# Altium project 带继电器产品.PrjPCB
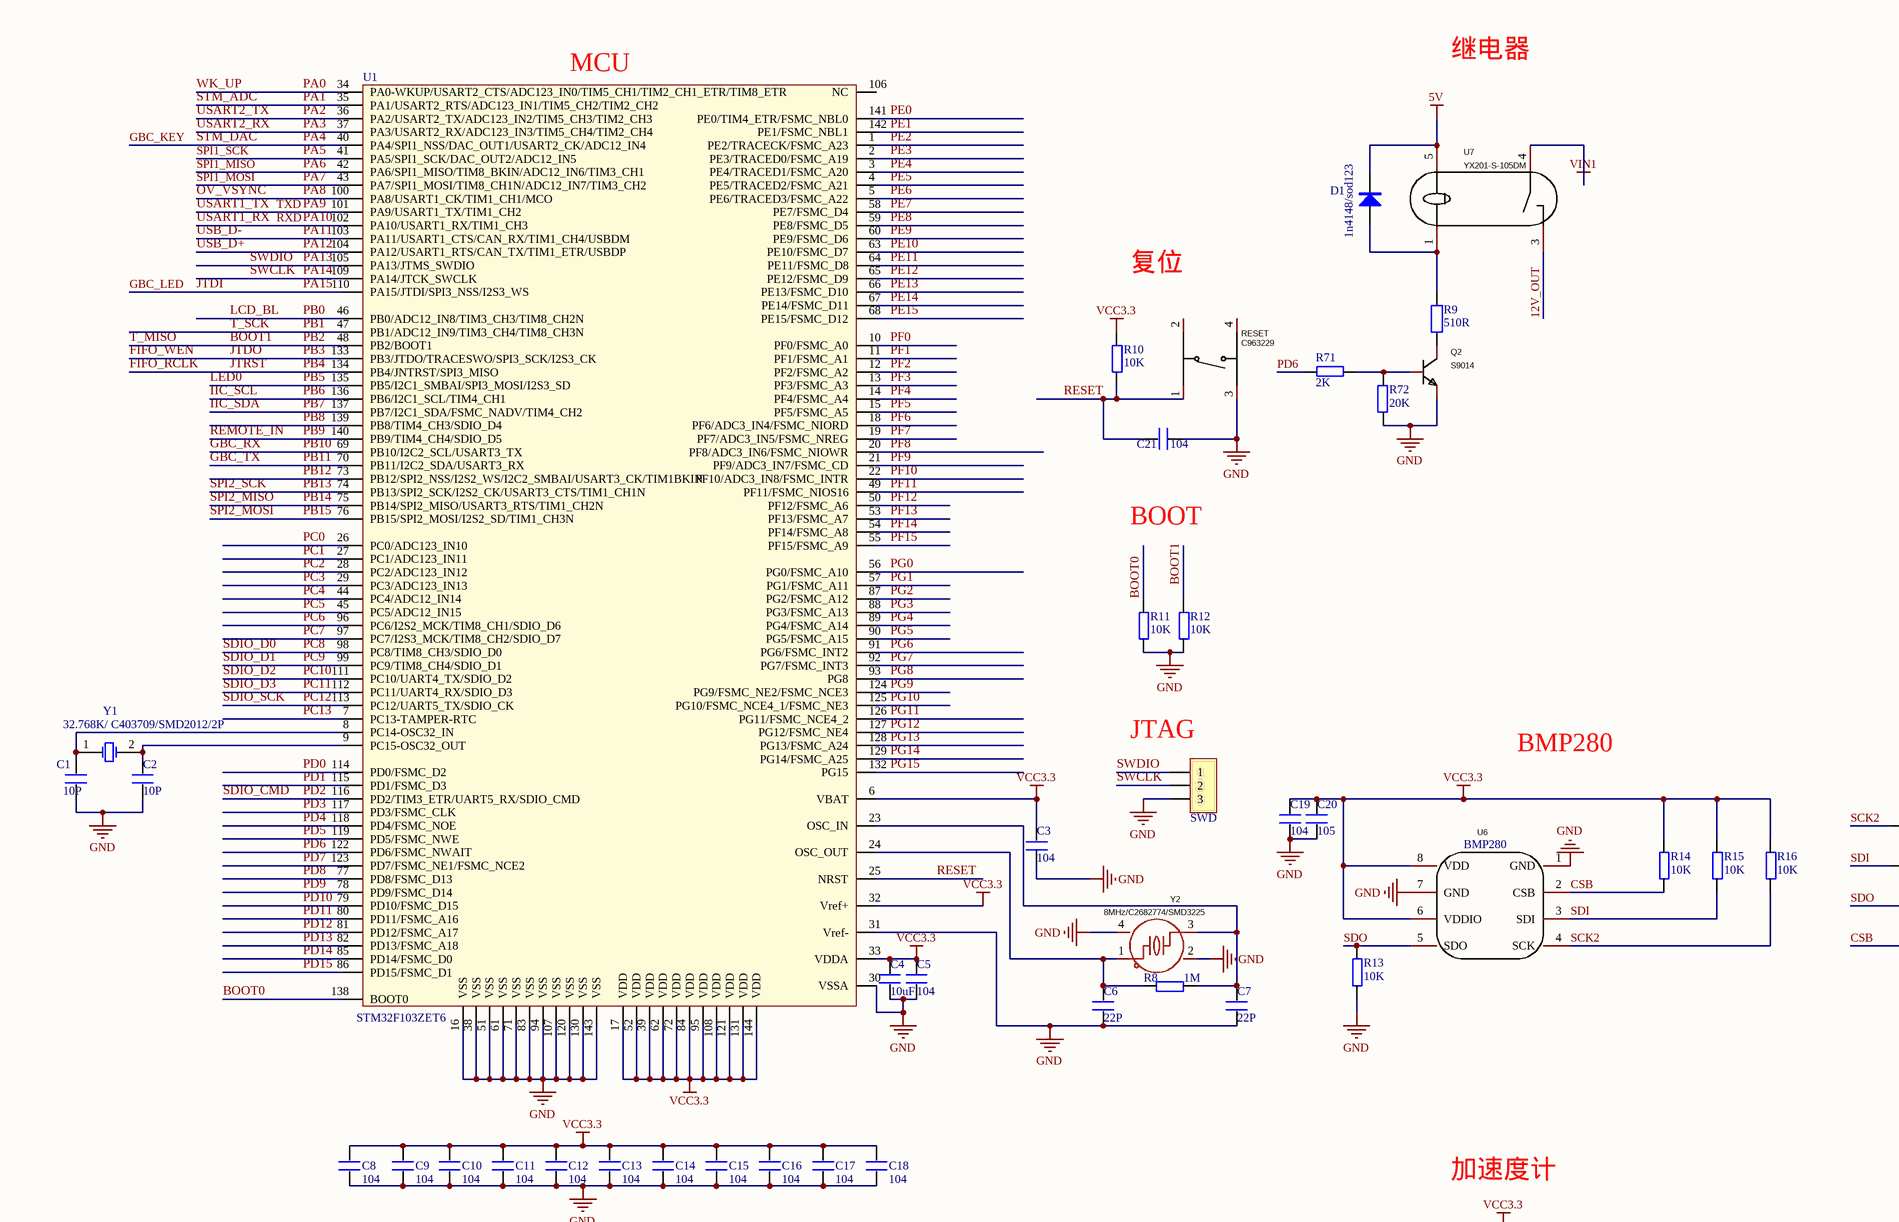
[diagram p0: 带继电器产品.SchDoc, top left]
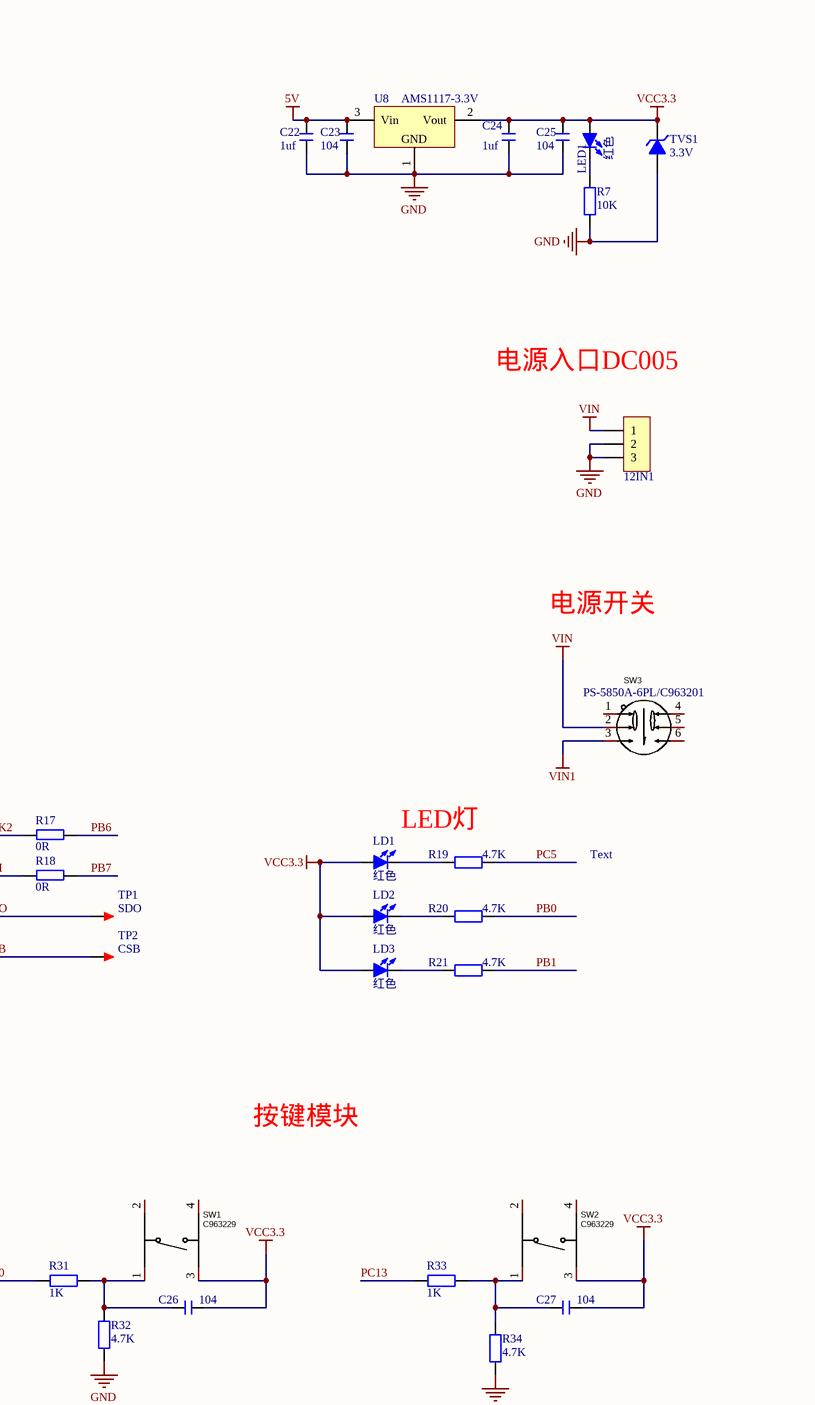
[diagram p1: 带继电器产品.SchDoc, top right]
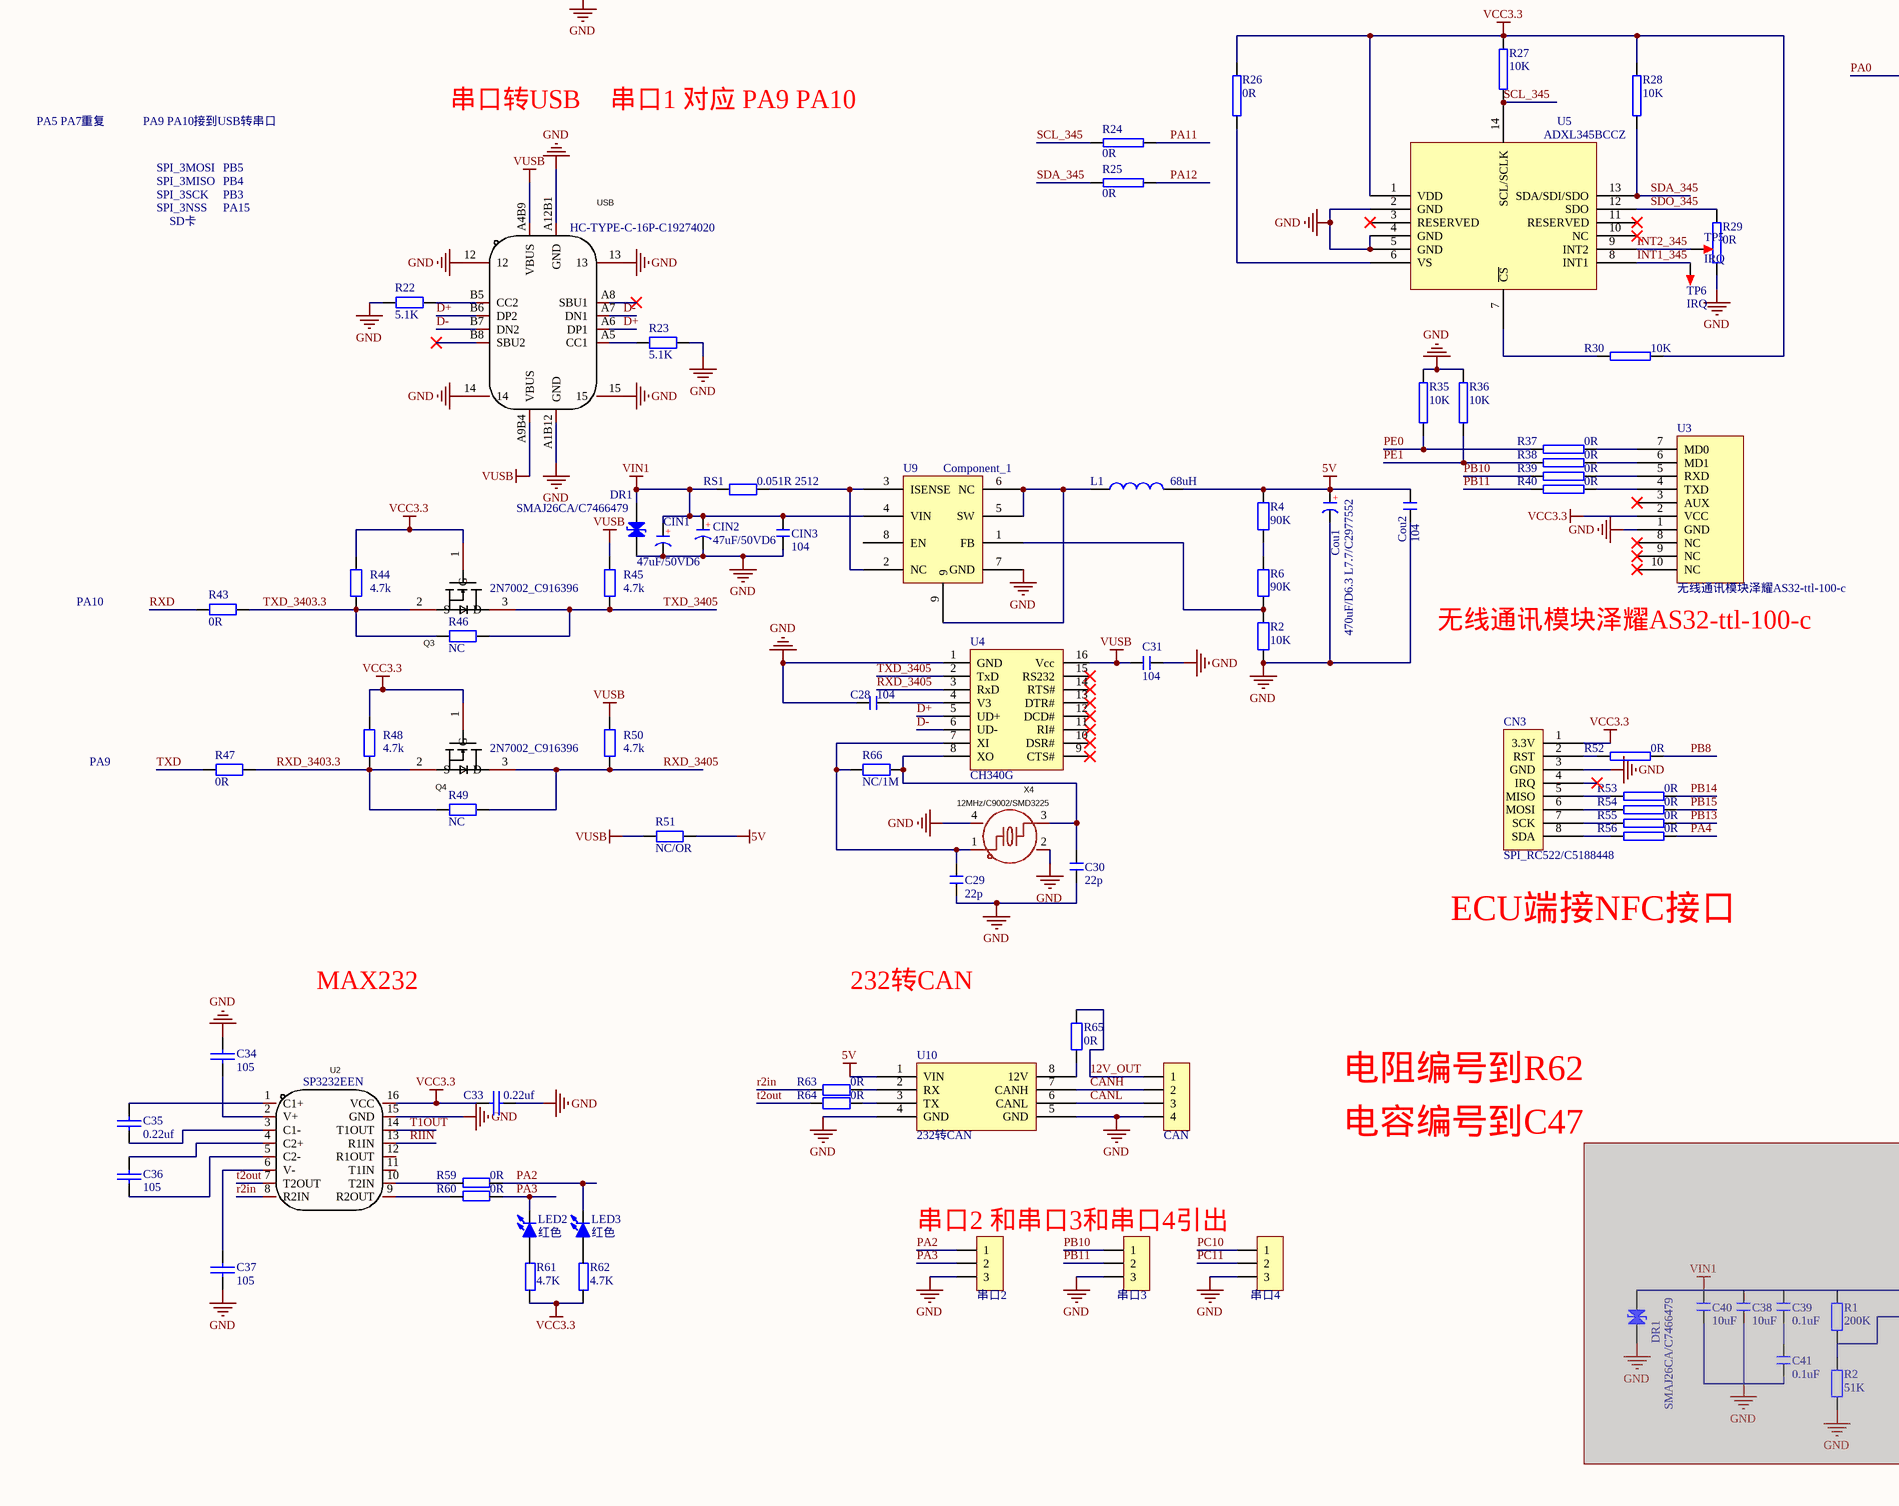
[diagram p2: 带继电器产品.SchDoc, bottom left]
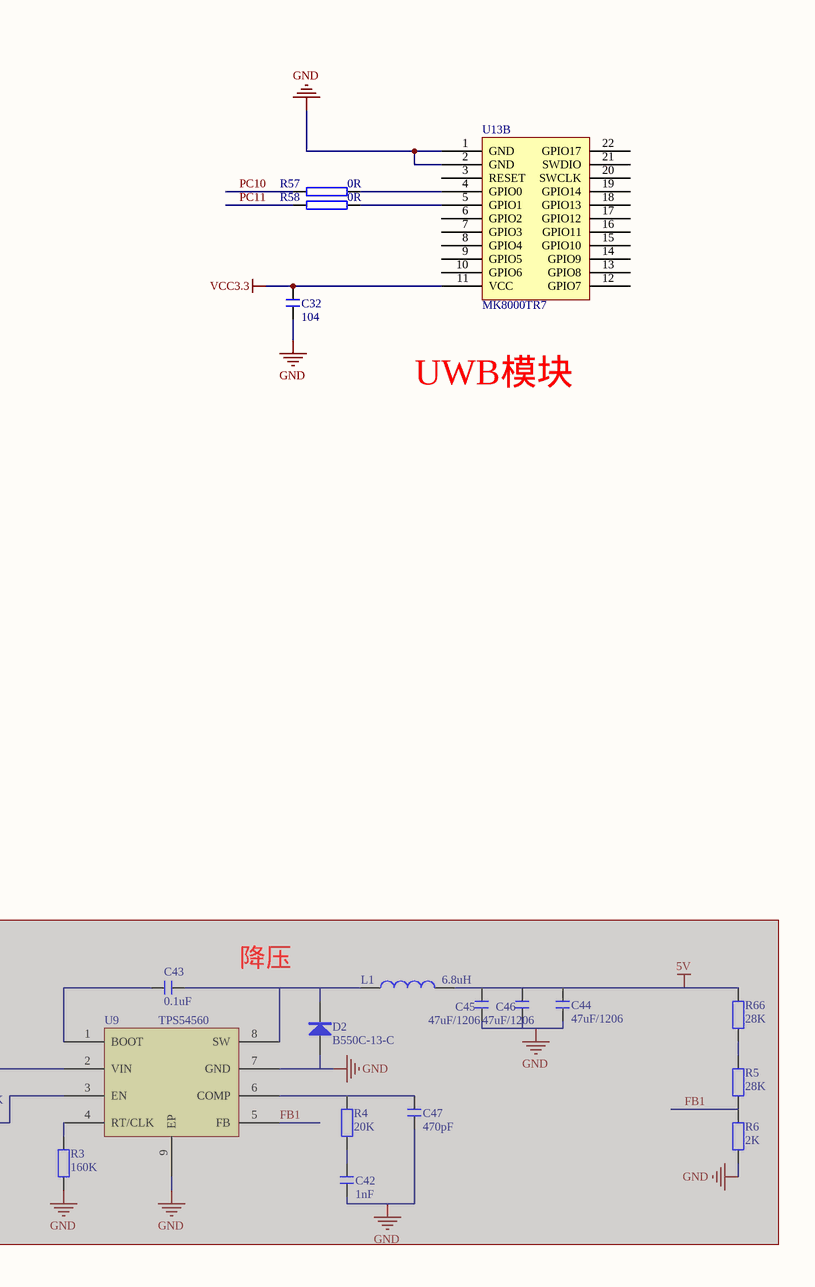
[diagram p3: 带继电器产品.SchDoc, bottom right]
1 sheet, 170 parts. Net scope: global (net labels, ports and power ports of the same name join across sheets).
Board file: 带继电器产品.PcbDoc

## Sheet 带继电器产品.SchDoc
size 508 x 508 mm

### Parts
(Parts that share a designator on the sheet are numbered #1, #2 ... from top to bottom, then left to right.)
12IN1  HDR-1X3  [DC-005]  (value not drawn)
C1  10P  [C0603_L]
C2  10P  [C0603_L]
C3  104  [C0603_L]
C4  10uF  [C0603_L]
C5  104  [C0603_L]
C6  22P  [C0603_L]
C7  22P  [C0603_L]
C8  104  [C0603_L]
C9  104  [C0603_L]
C10  104  [C0603_L]
C11  104  [C0603_L]
C12  104  [C0603_L]
C13  104  [C0603_L]
C14  104  [C0603_L]
C15  104  [C0603_L]
C16  104  [C0603_L]
C17  104  [C0603_L]
C18  104  [C0603_L]
C19  104  [C0603_L]
C20  105  [C0603_L]
C21  104  [C0603_L]
C22  1uf  [C0603_L]
C23  104  [C0603_L]
C24  1uf  [C0603_L]
C25  104  [C0603_L]
C26  104  [C0603_L]
C27  104  [C0603_L]
C28  104  [C0603_L]
C29  22p  [C0603_L]
C30  22p  [C0603_L]
C31  104  [C0603_L]
C32  104  [C0603_L]
C33  0.22uf  [C0603_L]
C34  105  [C0603_L]
C35  0.22uf  [C0603_L]
C36  105  [C0603_L]
C37  105  [C0603_L]
C38  10uF  [C0603_L]  (masked out: inside a compile mask, not in the netlist)
C39  0.1uF  [C0603_L]  (masked out: inside a compile mask, not in the netlist)
C40  10uF  [C0603_L]  (masked out: inside a compile mask, not in the netlist)
C41  0.1uF  [C0603_L]  (masked out: inside a compile mask, not in the netlist)
C42  1nF  [C0603_L]  (masked out: inside a compile mask, not in the netlist)
C43  0.1uF  [C0603_L]  (masked out: inside a compile mask, not in the netlist)
C44  47uF/1206  [C1206_L]  (masked out: inside a compile mask, not in the netlist)
C45  47uF/1206  [C1206_L]  (masked out: inside a compile mask, not in the netlist)
C46  47uF/1206  [C1206_L]  (masked out: inside a compile mask, not in the netlist)
C47  470pF  [C0603_L]  (masked out: inside a compile mask, not in the netlist)
CAN  HDR-1X4  [CAN/4P]  (value not drawn)
CIN1  47uF/50VD6  [C0805_L]
CIN2  47uF/50VD6  [C0805_L]
CIN3  104  [C0603_L]
CN3  SPI_RC522/C5188448  [SPI/8P]
Cou1  470uF/D6.3 L7.7/C2977552  [D6.3/470uf]
Cou2  104  [C0603_L]
D1  1n4148/sod123  [SOD-123]
D2  B550C-13-C  [SS56]  (masked out: inside a compile mask, not in the netlist)
DR1#1  SMAJ26CA/C7466479  [TVS]
DR1#2  SMAJ26CA/C7466479  [TVS]  (masked out: inside a compile mask, not in the netlist)
L1#1  68uH  [0530]
L1#2  6.8uH  [电感0650]  (masked out: inside a compile mask, not in the netlist)
LD1  红色  [LED0603_Y]
LD2  红色  [LED0603_Y]
LD3  红色  [LED0603_Y]
LED1  红色  [LED0603_Y]
LED2  红色  [LED0603_Y]
LED3  红色  [LED0603_Y]
Q2  S9014  [9014]
Q3  2N7002_C916396  [2N7002]
Q4  2N7002_C916396  [2N7002]
R1  200K  [R0603_L]  (masked out: inside a compile mask, not in the netlist)
R2#1  10K  [R0603_L]
R2#2  51K  [R0603_L]  (masked out: inside a compile mask, not in the netlist)
R3  160K  [R0603_L]  (masked out: inside a compile mask, not in the netlist)
R4#1  90K  [R0603_L]
R4#2  20K  [R0603_L]  (masked out: inside a compile mask, not in the netlist)
R5  28K  [R0603_L]  (masked out: inside a compile mask, not in the netlist)
R6#1  90K  [R0603_L]
R6#2  2K  [R0603_L]  (masked out: inside a compile mask, not in the netlist)
R7  10K  [R0603_L]
R8  1M  [R0603_L]
R9  510R  [R0603_L]
R10  10K  [R0603_L]
R11  10K  [R0603_L]
R12  10K  [R0603_L]
R13  10K  [R0603_L]
R14  10K  [R0603_L]
R15  10K  [R0603_L]
R16  10K  [R0603_L]
R17  0R  [R0603_L]
R18  0R  [R0603_L]
R19  4.7K  [R0603_L]
R20  4.7K  [R0603_L]
R21  4.7K  [R0603_L]
R22  5.1K  [R0603_L]
R23  5.1K  [R0603_L]
R24  0R  [R0603_L]
R25  0R  [R0603_L]
R26  0R  [R0603_L]
R27  10K  [R0603_L]
R28  10K  [R0603_L]
R29  0R  [R0603_L]
R30  10K  [R0603_L]
R31  1K  [R0603_L]
R32  4.7K  [R0603_L]
R33  1K  [R0603_L]
R34  4.7K  [R0603_L]
R35  10K  [R0603_L]
R36  10K  [R0603_L]
R37  0R  [R0603_L]
R38  0R  [R0603_L]
R39  0R  [R0603_L]
R40  0R  [R0603_L]
R43  0R  [R0603_L]
R44  4.7k  [R0603_L]
R45  4.7k  [R0603_L]
R46  NC  [R0603_L]
R47  0R  [R0603_L]
R48  4.7k  [R0603_L]
R49  NC  [R0603_L]
R50  4.7k  [R0603_L]
R51  NC/OR  [R0603_L]
R52  0R  [R0603_L]
R53  0R  [R0603_L]
R54  0R  [R0603_L]
R55  0R  [R0603_L]
R56  0R  [R0603_L]
R57  0R  [R0603_L]
R58  0R  [R0603_L]
R59  0R  [R0603_L]
R60  0R  [R0603_L]
R61  4.7K  [R0603_L]
R62  4.7K  [R0603_L]
R63  0R  [R0603_L]
R64  0R  [R0603_L]
R65  0R  [R0603_L]
R66#1  NC/1M  [R0603_L]
R66#2  28K  [R0603_L]  (masked out: inside a compile mask, not in the netlist)
R71  2K  [R0603_L]
R72  20K  [R0603_L]
RESET  C963229  [按键4.5*4.5]
RS1  0.051R 2512  [R1206_L]
SW1  C963229  [按键4.5*4.5]
SW2  C963229  [按键4.5*4.5]
SW3  PS-5850A-6PL/C963201  [电源开关]
SWD  HDR-1X3  [HDR2.54-LI-3P]  (value not drawn)
TP1  SDO  [测试点]
TP2  CSB  [测试点]
TP5  IRQ  [测试点]
TP6  IRQ  [测试点]
TVS1  3.3V  [SOD-123]
U1  STM32F103ZET6  [STME32F103ZET6]
U2  SP3232EEN  [max232]
U3  无线通讯模块泽耀AS32-ttl-100-c  [YAOZE]
U4  CH340G  [SOP16_M]
U5  ADXL345BCCZ  [ADXL345]
U6  BMP280  [BMP280]
U7  YX201-S-105DM  [继电器]
U8  AMS1117-3.3V  [1117-3.3]
U9#1  Component_1  [H4025/9脚]
U9#2  TPS54560  [TPS54560]  (masked out: inside a compile mask, not in the netlist)
U10  232转CAN  [CAN模块]
U13  MK8000TR7  [MK8000 PCB_V1.0封装]  (part B of 2)
USB  HC-TYPE-C-16P-C19274020  [TYPEC]
X4  12MHz/C9002/SMD3225  [SMD3225]
Y1  32.768K/ C403709/SMD2012/2P  [32.768K]
Y2  8MHz/C2682774/SMD3225  [SMD3225]
串口2  HDR-1X3  [HDR2.54-LI-3P]  (value not drawn)
串口3  HDR-1X3  [HDR2.54-LI-3P]  (value not drawn)
串口4  HDR-1X3  [HDR2.54-LI-3P]  (value not drawn)

### Nets
5V: C22.2 C23.2 Cou1.1(A) Cou2.2 D1.2(K) L1#1.2 R4#1.2 R51.2 U7.5 U8.3(Vin) U10.1(VIN)
GND: 12IN1.2 12IN1.3 C1.1 C2.1 C3.1 C4.1 C5.1 C6.1 C7.1 C8.2 C9.2 C10.2 C11.2 C12.2 C13.2 C14.2 C15.2 C16.2 C17.2 C18.2 C19.1 C20.1 C21.1 C22.1 C23.1 C24.1 C25.1 C28.1 C29.1 C30.1 C31.1 C32.2 C33.2 C34.1 C37.2 CAN.4 CIN1.2(K) CIN2.2(K) CIN3.1 CN3.3(GND) Cou1.2(K) Cou2.1 DR1#1.2(K) Q2.2(E) R2#1.1 R7.1 R11.1 R12.1 R13.1 R22.1 R23.2 R29.1 R32.1 R34.1 R35.2 R36.2 R72.2 RESET.3 SWD.3 TVS1.1(A) U1.16(VSS) U1.30(VSSA) U1.31(Vref-) U1.38(VSS) U1.51(VSS) U1.61(VSS) U1.71(VSS) U1.83(VSS) U1.94(VSS) U1.107(VSS) U1.120(VSS) U1.130(VSS) U1.143(VSS) U2.15(GND) U3.1(GND) U4.1(GND) U5.2(GND) U5.4(GND) U5.5(GND) U6.1(GND) U6.7(GND) U8.1(GND) U9#1.7(GND) U10.4(GND) U10.5(GND) U13.1(GND) U13.2(GND) USB.12 USB.13 USB.14 USB.15 USB.A1B12(GND) USB.A12B1(GND) X4.2(GND) X4.4(GND) Y2.2(GND) Y2.4(GND) 串口2.3 串口3.3 串口4.3
VCC3.3: C3.2 C4.2 C5.2 C8.1 C9.1 C10.1 C11.1 C12.1 C13.1 C14.1 C15.1 C16.1 C17.1 C18.1 C19.2 C20.2 C24.2 C25.2 C26.1 C27.1 C32.1 C33.1 CN3.1(3.3V) LD1.1(A) LD2.1(A) LD3.1(A) LED1.1(A) Q3.1(G) Q4.1(G) R10.2 R14.2 R15.2 R16.2 R26.2 R27.2 R28.2 R30.2 R44.2 R48.2 R61.1 R62.1 SW1.3 SW2.3 TVS1.2(K) U1.6(VBAT) U1.17(VDD) U1.32(Vref+) U1.33(VDDA) U1.39(VDD) U1.52(VDD) U1.62(VDD) U1.72(VDD) U1.84(VDD) U1.95(VDD) U1.108(VDD) U1.121(VDD) U1.131(VDD) U1.144(VDD) U2.16(VCC) U3.2(VCC) U5.1(VDD) U6.6(VDDIO) U6.8(VDD) U8.2(Vout) U13.11(VCC)
VIN: 12IN1.1 SW3.2
VIN1: CIN1.1(A) CIN2.1(A) CIN3.2 DR1#1.1(A) RS1.1 SW3.3 U7.4 U9#1.4(VIN)
VUSB: C31.2 R45.2 R50.2 R51.1 U4.16(Vcc) USB.A4B9(VBUS) USB.A9B4(VBUS)
12V_OUT: CAN.1 R65.2 U7.3
BOOT0: R11.2 U1.138(BOOT0)
BOOT1: R12.2 U1.48(PB2/BOOT1)  [also labelled PB2, T_MISO]
CANH: CAN.2 U10.7(CANH)
CANL: CAN.3 U10.6(CANL)
CSB: R14.1 TP2.1 U6.2(CSB)
D+: U4.5(UD+) USB.A6(DP1) USB.B6(DP2)
D-: U4.6(UD-) USB.A7(DN1) USB.B7(DN2)
FIFO_RCLK: U1.134(PB4/JNTRST/SPI3_MISO)  [also labelled JTRST, PB4]
FIFO_WEN: U1.133(PB3/JTDO/TRACESWO/SPI3_SCK/I2S3_CK)  [also labelled JTDO, PB3]
GBC_KEY: R56.2 U1.40(PA4/SPI1_NSS/DAC_OUT1/USART2_CK/ADC12_IN4)  [also labelled PA4, STM_DAC]
GBC_LED: U1.110(PA15/JTDI/SPI3_NSS/I2S3_WS)  [also labelled JTDI, PA15]
GBC_RX: R39.1 U1.69(PB10/I2C2_SCL/USART3_TX) 串口3.1  [also labelled PB10]
GBC_TX: R40.1 U1.70(PB11/I2C2_SDA/USART3_RX) 串口3.2  [also labelled PB11]
IIC_SCL: R17.1 U1.136(PB6/I2C1_SCL/TIM4_CH1)  [also labelled PB6]
IIC_SDA: R18.1 U1.137(PB7/I2C1_SDA/FSMC_NADV/TIM4_CH2)  [also labelled PB7]
INT1_345: TP6.1 U5.8(INT1)
INT2_345: TP5.1 U5.9(INT2)
LCD_BL: R20.1 U1.46(PB0/ADC12_IN8/TIM3_CH3/TIM8_CH2N)  [also labelled PB0]
LED0: U1.135(PB5/I2C1_SMBAI/SPI3_MOSI/I2S3_SD)  [also labelled PB5]
OV_VSYNC: U1.100(PA8/USART1_CK/TIM1_CH1/MCO)  [also labelled PA8]
PA0: R31.1 U1.34(PA0-WKUP/USART2_CTS/ADC123_IN0/TIM5_CH1/TIM2_CH1_ETR/TIM8_ETR)  [also labelled WK_UP]
PA1: U1.35(PA1/USART2_RTS/ADC123_IN1/TIM5_CH2/TIM2_CH2)  [also labelled STM_ADC]
PA2: LED3.2(K) R59.1 U1.36(PA2/USART2_TX/ADC123_IN2/TIM5_CH3/TIM2_CH3) 串口2.1  [also labelled USART2_TX]
PA3: LED2.2(K) R60.1 U1.37(PA3/USART2_RX/ADC123_IN3/TIM5_CH4/TIM2_CH4) 串口2.2  [also labelled USART2_RX]
PA5: U1.41(PA5/SPI1_SCK/DAC_OUT2/ADC12_IN5)  [also labelled SPI1_SCK]
PA6: U1.42(PA6/SPI1_MISO/TIM8_BKIN/ADC12_IN6/TIM3_CH1)  [also labelled SPI1_MISO]
PA7: U1.43(PA7/SPI1_MOSI/TIM8_CH1N/ADC12_IN7/TIM3_CH2)  [also labelled SPI1_MOSI]
PA9: R47.2 U1.101(PA9/USART1_TX/TIM1_CH2)  [also labelled TXD, USART1_TX]
PA10: R43.2 U1.102(PA10/USART1_RX/TIM1_CH3)  [also labelled RXD, USART1_RX]
PA11: R24.1 U1.103(PA11/USART1_CTS/CAN_RX/TIM1_CH4/USBDM)  [also labelled USB_D-]
PA12: R25.1 U1.104(PA12/USART1_RTS/CAN_TX/TIM1_ETR/USBDP)  [also labelled USB_D+]
PA13: SWD.1 U1.105(PA13/JTMS_SWDIO)  [also labelled SWDIO]
PA14: SWD.2 U1.109(PA14/JTCK_SWCLK)  [also labelled SWCLK]
PB1: R21.1 U1.47(PB1/ADC12_IN9/TIM3_CH4/TIM8_CH3N)  [also labelled T_SCK]
PB8: R52.2 U1.139(PB8/TIM4_CH3/SDIO_D4)
PB9: U1.140(PB9/TIM4_CH4/SDIO_D5)  [also labelled REMOTE_IN]
PB12: U1.73(PB12/SPI2_NSS/I2S2_WS/I2C2_SMBAI/USART3_CK/TIM1BKIN)
PB13: R55.2 U1.74(PB13/SPI2_SCK/I2S2_CK/USART3_CTS/TIM1_CH1N)  [also labelled SPI2_SCK]
PB14: R53.2 U1.75(PB14/SPI2_MISO/USART3_RTS/TIM1_CH2N)  [also labelled SPI2_MISO]
PB15: R54.2 U1.76(PB15/SPI2_MOSI/I2S2_SD/TIM1_CH3N)  [also labelled SPI2_MOSI]
PC0: U1.26(PC0/ADC123_IN10)
PC1: U1.27(PC1/ADC123_IN11)
PC2: U1.28(PC2/ADC123_IN12)
PC3: U1.29(PC3/ADC123_IN13)
PC4: U1.44(PC4/ADC12_IN14)
PC5: R19.1 U1.45(PC5/ADC12_IN15)
PC6: U1.96(PC6/I2S2_MCK/TIM8_CH1/SDIO_D6)
PC7: U1.97(PC7/I2S3_MCK/TIM8_CH2/SDIO_D7)
PC8: U1.98(PC8/TIM8_CH3/SDIO_D0)  [also labelled SDIO_D0]
PC9: U1.99(PC9/TIM8_CH4/SDIO_D1)  [also labelled SDIO_D1]
PC10: R57.1 U1.111(PC10/UART4_TX/SDIO_D2) 串口4.1  [also labelled SDIO_D2]
PC11: R58.1 U1.112(PC11/UART4_RX/SDIO_D3) 串口4.2  [also labelled SDIO_D3]
PC12: U1.113(PC12/UART5_TX/SDIO_CK)  [also labelled SDIO_SCK]
PC13: R33.1 U1.7(PC13-TAMPER-RTC)
PD0: U1.114(PD0/FSMC_D2)
PD1: U1.115(PD1/FSMC_D3)
PD2: U1.116(PD2/TIM3_ETR/UART5_RX/SDIO_CMD)  [also labelled SDIO_CMD]
PD3: U1.117(PD3/FSMC_CLK)
PD4: U1.118(PD4/FSMC_NOE)
PD5: U1.119(PD5/FSMC_NWE)
PD6: R71.2 U1.122(PD6/FSMC_NWAIT)
PD7: U1.123(PD7/FSMC_NE1/FSMC_NCE2)
PD8: U1.77(PD8/FSMC_D13)
PD9: U1.78(PD9/FSMC_D14)
PD10: U1.79(PD10/FSMC_D15)
PD11: U1.80(PD11/FSMC_A16)
PD12: U1.81(PD12/FSMC_A17)
PD13: U1.82(PD13/FSMC_A18)
PD14: U1.85(PD14/FSMC_D0)
PD15: U1.86(PD15/FSMC_D1)
PE0: R35.1 R37.1 U1.141(PE0/TIM4_ETR/FSMC_NBL0)
PE1: R36.1 R38.1 U1.142(PE1/FSMC_NBL1)
PE2: U1.1(PE2/TRACECK/FSMC_A23)
PE3: U1.2(PE3/TRACED0/FSMC_A19)
PE4: U1.3(PE4/TRACED1/FSMC_A20)
PE5: U1.4(PE5/TRACED2/FSMC_A21)
PE6: U1.5(PE6/TRACED3/FSMC_A22)
PE7: U1.58(PE7/FSMC_D4)
PE8: U1.59(PE8/FSMC_D5)
PE9: U1.60(PE9/FSMC_D6)
PE10: U1.63(PE10/FSMC_D7)
PE11: U1.64(PE11/FSMC_D8)
PE12: U1.65(PE12/FSMC_D9)
PE13: U1.66(PE13/FSMC_D10)
PE14: U1.67(PE14/FSMC_D11)
PE15: U1.68(PE15/FSMC_D12)
PF0: U1.10(PF0/FSMC_A0)
PF1: U1.11(PF1/FSMC_A1)
PF2: U1.12(PF2/FSMC_A2)
PF3: U1.13(PF3/FSMC_A3)
PF4: U1.14(PF4/FSMC_A4)
PF5: U1.15(PF5/FSMC_A5)
PF6: U1.18(PF6/ADC3_IN4/FSMC_NIORD)
PF7: U1.19(PF7/ADC3_IN5/FSMC_NREG)
PF8: U1.20(PF8/ADC3_IN6/FSMC_NIOWR)
PF9: U1.21(PF9/ADC3_IN7/FSMC_CD)
PF10: U1.22(PF10/ADC3_IN8/FSMC_INTR)
PF11: U1.49(PF11/FSMC_NIOS16)
PF12: U1.50(PF12/FSMC_A6)
PF13: U1.53(PF13/FSMC_A7)
PF14: U1.54(PF14/FSMC_A8)
PF15: U1.55(PF15/FSMC_A9)
PG0: U1.56(PG0/FSMC_A10)
PG1: U1.57(PG1/FSMC_A11)
PG2: U1.87(PG2/FSMC_A12)
PG3: U1.88(PG3/FSMC_A13)
PG4: U1.89(PG4/FSMC_A14)
PG5: U1.90(PG5/FSMC_A15)
PG6: U1.91(PG6/FSMC_INT2)
PG7: U1.92(PG7/FSMC_INT3)
PG8: U1.93(PG8)
PG9: U1.124(PG9/FSMC_NE2/FSMC_NCE3)
PG10: U1.125(PG10/FSMC_NCE4_1/FSMC_NE3)
PG11: U1.126(PG11/FSMC_NCE4_2)
PG12: U1.127(PG12/FSMC_NE4)
PG13: U1.128(PG13/FSMC_A24)
PG14: U1.129(PG14/FSMC_A25)
PG15: U1.132(PG15)
r2in: R63.1 U2.8(R2IN)
RESET: C21.2 R10.1 RESET.1 U1.25(NRST)
RIIN: U2.13(R1IN)
RXD_3403.3: Q4.2(S) R47.1 R48.1 R49.2
RXD_3405: Q4.3(D) R49.1 R50.1 U4.3(RxD)
SCK2: R16.1 R17.2 U6.4(SCK)
SCL_345: R24.2 R27.1 U5.14(SCL/SCLK)
SDA_345: R25.2 R28.1 U5.13(SDA/SDI/SDO)
SDI: R15.1 R18.2 U6.3(SDI)
SDO: R13.2 TP1.1 U6.5(SDO)
SDO_345: R29.2 U5.12(SDO)
T1OUT: U2.14(T1OUT)
t2out: R64.1 U2.7(T2OUT)
TXD_3403.3: Q3.2(S) R43.1 R44.1 R46.2
TXD_3405: Q3.3(D) R45.1 R46.1 U4.2(TxD)
NetC1_2: C1.2 U1.8(PC14-OSC32_IN) Y1.1(OSC1)
NetC2_2: C2.2 U1.9(PC15-OSC32_OUT) Y1.2(OSC2)
NetC6_2: C6.2 R8.1 U1.24(OSC_OUT) Y2.1
NetC7_2: C7.2 R8.2 U1.23(OSC_IN) Y2.3
NetC26_2: C26.2 R31.2 R32.2 SW1.1
NetC27_2: C27.2 R33.2 R34.2 SW2.1
NetC28_2: C28.2 U4.4(V3)
NetC29_2: C29.2 R66#1.1 U4.7(XI) X4.1
NetC30_2: C30.2 R66#1.2 U4.8(XO) X4.3
NetC34_2: C34.2 U2.2(V+)
NetC35_1: C35.1 U2.1(C1+)
NetC35_2: C35.2 U2.3(C1-)
NetC36_1: C36.1 U2.4(C2+)
NetC36_2: C36.2 U2.5(C2-)
NetC37_1: C37.1 U2.6(V-)
NetCN3_2: CN3.2(RST) R52.1
NetCN3_5: CN3.5(MISO) R53.1
NetCN3_6: CN3.6(MOSI) R54.1
NetCN3_7: CN3.7(SCK) R55.1
NetCN3_8: CN3.8(SDA) R56.1
NetD1_1: D1.1(A) R9.1 U7.1
NetL1#1_1: L1#1.1 U9#1.5(SW) U9#1.6(NC) U9#1.9
NetLD1_2: LD1.2(K) R19.2
NetLD2_2: LD2.2(K) R20.2
NetLD3_2: LD3.2(K) R21.2
NetLED1_2: LED1.2(K) R7.2
NetLED2_1: LED2.1(A) R61.2
NetLED3_1: LED3.1(A) R62.2
NetQ2_1: Q2.1(B) R71.1 R72.1
NetQ2_3: Q2.3(C) R9.2
NetR2#1_2: R2#1.2 R6#1.1 U9#1.1(FB)
NetR4#1_1: R4#1.1 R6#1.2
NetR22_2: R22.2 USB.B5(CC2)
NetR23_1: R23.1 USB.A5(CC1)
NetR26_1: R26.1 U5.6(VS)
NetR30_1: R30.1 U5.7(~{CS})
NetR37_2: R37.2 U3.7(MD0)
NetR38_2: R38.2 U3.6(MD1)
NetR39_2: R39.2 U3.5(RXD)
NetR40_2: R40.2 U3.4(TXD)
NetR57_2: R57.2 U13.4(GPIO0)
NetR58_2: R58.2 U13.5(GPIO1)
NetR59_2: R59.2 U2.10(T2IN)
NetR60_2: R60.2 U2.9(R2OUT)
NetR63_2: R63.2 U10.2(RX)
NetR64_2: R64.2 U10.3(TX)
NetR65_1: R65.1 U10.8(12V)
NetRS1_2: RS1.2 U9#1.2(NC) U9#1.3(ISENSE)

Not connected (* = marked no-connect by the designer): CN3 4(IRQ)*; RESET 2 4; SW1 2 4; SW2 2 4; SW3 1 4 5 6; U1 106(NC); U2 11(T1IN) 12(R1OUT); U3 3(AUX)* 8(NC)* 9(NC)* 10(NC)*; U4 9(CTS#)* 10(DSR#)* 11(RI#)* 12(DCD#)* 13(DTR#)* 14(RTS#)* 15(RS232)*; U5 3(RESERVED)* 10(NC)* 11(RESERVED)*; U9#1 8(EN); U13 3(RESET) 6(GPIO2) 7(GPIO3) 8(GPIO4) 9(GPIO5) 10(GPIO6) 12(GPIO7) 13(GPIO8) 14(GPIO9) 15(GPIO10) 16(GPIO11) 17(GPIO12) 18(GPIO13) 19(GPIO14) 20(SWCLK) 21(SWDIO) 22(GPIO17); USB A8(SBU1)* B8(SBU2)*

### Notes on the sheet
- (near U1) MCU
- 继电器
- 复位
- 电源入口DC005
- BOOT
- 电源开关
- (near SWD) JTAG
- BMP280
- LED灯
- Text
- 按键模块
- 加速度计
- PA5 PA7重复
- PA9 PA10接到USB转串口
- 串口转USB
- 串口1 对应 PA9 PA10
- SPI_3MOSI
- SPI_3MISO
- SPI_3SCK
- SPI_3NSS
- PB5
- PB4
- PB3
- PA15
- SD卡
- PA10
- UWB模块
- (near U3) 无线通讯模块泽耀AS32-ttl-100-c
- PA9
- ECU端接NFC接口
- MAX232
- 232转CAN
- 电阻编号到R62
- 电容编号到C47
- 降压
- (near 串口2) 串口2 和串口3和串口4引出
- (in symbol CE) +

### Library data of the parts
12IN1 = Header 3: 3P接插件; 版权归属: 封装库来自淘宝 ID：黄晶宝石; BOM名称: 3P接插件; 学习资源: https://shop463601444.taobao.com
C1-C21 = C
C22-C32 = C: 无极性贴片电容; 版权归属: 源创客; 材质: X7R; BOM名称: 无极性贴片电容; 学习资源: www.ooocke.com
C33-C37 = CAP: Capacitor
C38-C47 CIN3 Cou2 = C: 贴片电容; BOM名称: 无极性贴片电容; 淘宝ID: 封装库来自淘宝 ID：黄晶宝石; 联系售后，技术支持: https://shop463601444.taobao.com; 唯一出售店铺网址: https://shop463601444.taobao.com
CAN = Header 4: 4P接插件; 版权归属: 封装库来自淘宝 ID：黄晶宝石; 学习资源: 最新版本发布https://item.taobao.com/item.htm?id=566775463719; BOM名称: 4P接插件
CIN1 CIN2 Cou1 = CE: 直插电解电容; 淘宝ID: 封装库来自淘宝 ID：黄晶宝石; BOM名称: 直插电解电容; 联系售后: https://item.taobao.com/item.htm?id=566775463719
CN3 = SPI_RC522
D1 D2 = 1N4007: 整流二极管; 淘宝ID: 封装库来自淘宝 ID：黄晶宝石; 封装库来自淘宝卖家 ID：黄晶宝石: 其他店铺购入均为盗版，不享受售后技术支持服务，请立即申请退款; BOM名称: 整流二极管; 联系售后，技术支持: https://shop463601444.taobao.com
DR1#1 DR1#2 = DR: 瞬态电压抑制二极管; 版权归属: 封装库来自淘宝 ID：黄晶宝石; BOM名称: 瞬态电压抑制二极管; 学习资源: https://item.taobao.com/item.htm?id=566775463719
L1#1 L1#2 = L: 小功率贴片电感; 淘宝ID: 封装库来自淘宝 ID：黄晶宝石; 封装库来自淘宝卖家 ID：黄晶宝石: 其他店铺购入均为盗版，不享受售后技术支持服务，请立即申请退款; BOM名称: 小功率贴片电感; 联系售后: https://item.taobao.com/item.htm?id=566775463719
LD1-LD3 = LED-SMD: 贴片LED; 版权归属: 封装库来自淘宝 ID：黄晶宝石; BOM名称: 贴片LED; 学习资源: https://item.taobao.com/item.htm?id=566775463719
LED1-LED3 = LED-SMD: 贴片LED; 版权归属: 源创客; BOM名称: 贴片LED; 学习资源: www.ooocke.com
Q2 = S9014_C2148: Manufacturer: CJ(江苏长电/长晶); Symbol: S9014LT1 (S9014 J6); Add into BOM: yes; Transistor Type: NPN; Collector Current (Ic): 100mA; Collector-Emitter Breakdown Voltage (Vceo): 45V; Power Dissipation (Pd): 200mW; DC Current Gain (hFE@Ic,Vce): 300@1mA,5V; Transition Frequency (fT): 150MHz; Collector Cut-Off Current (Icbo): 100nA; Collector-Emitter Saturation Voltage (VCE(sat)@Ic,Ib): 300mV@100mA,5mA; Name: S9014; Device: S9014_C2148; LCSC Part Name: NPN 电流:100mA 耐压:45V J6  250-400; Supplier Part: C2148; Manufacturer Part: S9014; Supplier Footprint: SOT-23; JLCPCB Part Class: Extended Part; Datasheet: https://atta.szlcsc.com/upload/public/pdf/source/20120512/1457706508772.pdf; Supplier: LCSC; Convert to PCB: yes; Operating Temperature: -
Q3 Q4 = 2N7002_C916396: Manufacturer: JSMSEMI(��ʢ΢); Add into BOM: yes; Type: N����; Drain Source Voltage (Vdss): 60V; Continuous Drain Current (Id): 115mA; Power Dissipation (Pd): 200mW; Drain Source On Resistance (RDS(on)@Vgs,Id): 1.2��@10V,500mA; Gate Threshold Voltage (Vgs(th)@Id): 2.1V@250uA; Input Capacitance (Ciss@Vds): 20pF@25V; Reverse Transfer Capacitance (Crss@Vds): 4pF@25V; Symbol: 2N7002_C916396; Device: 2N7002_C916396; LCSC Part Name: N���� ��ѹ:60V ����:115mA; Supplier Part: C916396; Manufacturer Part: 2N7002; Supplier Footprint: SOT-23; JLCPCB Part Class: Extended Part; Datasheet: https://atta.szlcsc.com/upload/public/pdf/source/20230714/89F30C6A193AD72E5F1F14B53E304F4A.pdf; Supplier: LCSC; Convert to PCB: yes; Total Gate Charge (Qg@Vgs): -; Operating Temperature: -
R1 R2#1 R2#2 R3 R4#1 R4#2 R5 R6#1 R6#2 R66#2 RS1 = R: 贴片电阻; 版权归属: 来自淘宝 ID：黄晶宝石; 封装库来自淘宝卖家 ID：黄晶宝石: 其他店铺购入均为盗版，不享受售后技术支持服务，请立即申请退款; BOM名称: 贴片电阻; 联系售后: https://item.taobao.com/item.htm?id=566775463719
R7 R9 R19-R23 R31-R34 R43-R51 R63-R65 R66#1 = R: 贴片电阻; 版权归属: 源创客; BOM名称: 贴片电阻; 学习资源: www.ooocke.com
R8 R10-R18 R59-R62 R71 R72 = R
R24-R30 R35-R40 R52-R58 = RES2
RESET SW1 SW2 = KH-6X6X15H-TJ-FS: Manufacturer: kinghelm(金航标); Add into BOM: yes; Switch Length: 6mm; Switch Height: 15mm; Name: KH-6X6X15H-TJ-FS; Symbol: KH-6X6X15H-TJ-FS; Device: KH-6X6X15H-TJ-FS; LCSC Part Name: 轻触开关6*6*15H防水插件 袋装; Supplier Part: C18186507; Manufacturer Part: KH-6X6X15H-TJ-FS; Supplier Footprint: 插件,6x6mm; JLCPCB Part Class: Extended Part; Datasheet: https://atta.szlcsc.com/upload/public/pdf/source/20230919/D9CCD7809835D0ED78B9AD9A3C5FB651.pdf; Supplier: LCSC; Convert to PCB: yes; Switch Width: 6mm
SW3 = PS-5850A-6PL: Manufacturer: G-Switch(品赞); Add into BOM: yes; Circuit: 双刀双掷; Self Lock / No Lock: 自锁; Actuator Style: 矩形柱塞; Contact Current: 500mA; Voltage Rating (DC): 30V; Insulation Resistance: 100MΩ; Actuator/Cap Color: 黑色; Pin Style: PC引脚; Mechanical Life: 10万次; Symbol: PS-5850A-6PL; Device: PS-5850A-6PL; LCSC Part Name: 自锁按键开关; Supplier Part: C963201; Manufacturer Part: PS-5850A-6PL; Supplier Footprint: 插件; JLCPCB Part Class: Extended Part; Datasheet: https://atta.szlcsc.com/upload/public/pdf/source/20201201/C963201_9229C247AC907A82E381B4EE0BC1DEDE.pdf; Supplier: LCSC; Convert to PCB: yes; IP Rating: -; Mounting Style: 直插; Voltage Rating (AC): -; With Lamp: -; Operating Force: -; Operating Temperature: -25℃~+65℃
SWD 串口2-串口4 = Header 3: 3P接插件; 版权归属: 封装库来自淘宝 ID：黄晶宝石; 学习资源: 最新版本发布https://item.taobao.com/item.htm?id=566775463719; BOM名称: 3P接插件
TP1 TP2 TP5 TP6 = TEST TP: 测试环; 版权归属: 封装库来自淘宝 ID：黄晶宝石; BOM名称: 测试环; 学习资源: https://shop463601444.taobao.com
TVS1 = 1N4102: 8.7V/0.5W稳压管; 版权归属: 源创客; BOM名称: 8.7V/0.5W稳压管; 学习资源: www.ooocke.com
U2 = SP3232EEN: Manufacturer: UMW(友台半导体); Add into BOM: yes; Types: 收发器; Driver/receiver: 2/2; Data Rate: 250Kbps; Supply Voltage: 3V~3.6V；4.5V~5.5V; Symbol: SP3232EEN; Device: SP3232EEN; LCSC Part Name: 3.0V至5.5V低功率多通道RS-232线收发器 使用0.1μF外部电容; Supplier Part: C2904739; Manufacturer Part: SP3232EEN; Supplier Footprint: SOP-16; JLCPCB Part Class: Extended Part; Datasheet: https://atta.szlcsc.com/upload/public/pdf/source/20240122/238E83A7FACD35D5900508085B93A751.pdf; Supplier: LCSC; Convert to PCB: yes; Operating Temperature: 0℃~+70℃
U3 U9#2 U10 = Component_1
U4 = CH340G: 串口转USB; 版权归属: 源创客; BOM名称: 串口转USB; 学习资源: www.ooocke.com
U6 = BMP280: Manufacturer: Bosch(博世); Add into BOM: yes; Symbol: BMP280; Device: BMP280; Supplier: LCSC; Manufacturer Part: BMP280; Supplier Part: C83291; JLCPCB Part Class: Extended Part; LCSC Part Name: BMP280; Supplier Footprint: LGA-8(2x2.5); Datasheet: https://atta.szlcsc.com/upload/public/pdf/source/20200702/C83291_F39E84AB7DFC569A4C7554F8659640A1.pdf; Convert to PCB: yes
U7 = YX201-S-105DM: Manufacturer: YONGNENG(永能); Add into BOM: yes; Coil Voltage: 5V; Contact Form: 一组常开:1A(单刀单掷-常开); Pin Number: 4; Maximum Switching Voltage: 250V@AC; Coil Rated Power: 450mW; Maximum Switching Current: 5A; Coil Resistance: 56Ω; Contact Resistance: 100mΩ; Operate Time: 10ms; Release Time: 5ms; Name: YX201-S-105DM; Symbol: YX201-S-105DM; Device: YX201-S-105DM; LCSC Part Name: YX201-S-105DM; Supplier Part: C19193875; Manufacturer Part: YX201-S-105DM; Supplier Footprint: DIP-4; JLCPCB Part Class: Extended Part; Datasheet: https://atta.szlcsc.com/upload/public/pdf/source/20231117/D7EEF9F25789DD0D30287C0CF40E6927.pdf; Supplier: LCSC; Convert to PCB: yes; Contact Material: 银合金; Operating Temperature: -40℃~+105℃
U8 = AMS1117: 三端稳压芯片; BOM名称: 稳压芯片; 版权归属: 源创客; 学习资源: www.ooocke.com
USB = HC-TYPE-C-16P-C08B: Manufacturer: HC(��ɵ���); Add into BOM: yes; Connector Type: Type-C; Gender: ĸ; Number of Ports: 1; Number of Contacts: 16P; Current Rating - Power (Max): 3A; Soldering Temperature(Max): 260��; Symbol: HC-TYPE-C-16P-C08B; Device: HC-TYPE-C-16P-C08B; Supplier: LCSC; Supplier Part: C19274020; Manufacturer Part: HC-TYPE-C-16P-C08B; LCSC Part Name: Type-C ĸ ����; Supplier Footprint: SMD; Datasheet: https://atta.szlcsc.com/upload/public/pdf/source/20231201/06F4DD99D9C2226B5D2A100A011641DD.pdf; Convert to PCB: yes; Standard: USB 3.1; Mounting Style: ����; Contact Material: ͭ�Ͻ�; Contact Plating: ��; Operating Temperature Range: -25��~+85��
X4 Y2 = X32258MSB4SI: Manufacturer: YXC(扬兴晶振); Add into BOM: yes; Value: 8MHz; Normal temperature Frequency Tolerance: ±10ppm; Load Capacitance: 20pF; Frequency Stability: ±20ppm; Symbol: X32258MSB4SI; Device: X32258MSB4SI; LCSC Part Name: 8MHz ±10ppm 20pF; Supplier Part: C2682774; Manufacturer Part: X32258MSB4SI; Supplier Footprint: SMD3225-4P; JLCPCB Part Class: Extended Part; Datasheet: https://atta.szlcsc.com/upload/public/pdf/source/20240329/19D5F850207469550BEB00D7DFEDBC7A.pdf; Supplier: LCSC; Convert to PCB: yes; Type: 贴片晶振; Operating Temperature: -40℃~+85℃
Y1 = XTAL_1: Crystal Oscillator; Published: 8-Jun-2000; LatestRevisionDate: 17-Jul-2002; LatestRevisionNote: Re-released for DXP Platform.; Publisher: Altium Limited